# EAGLE design main (EAGLE 9.3.0)
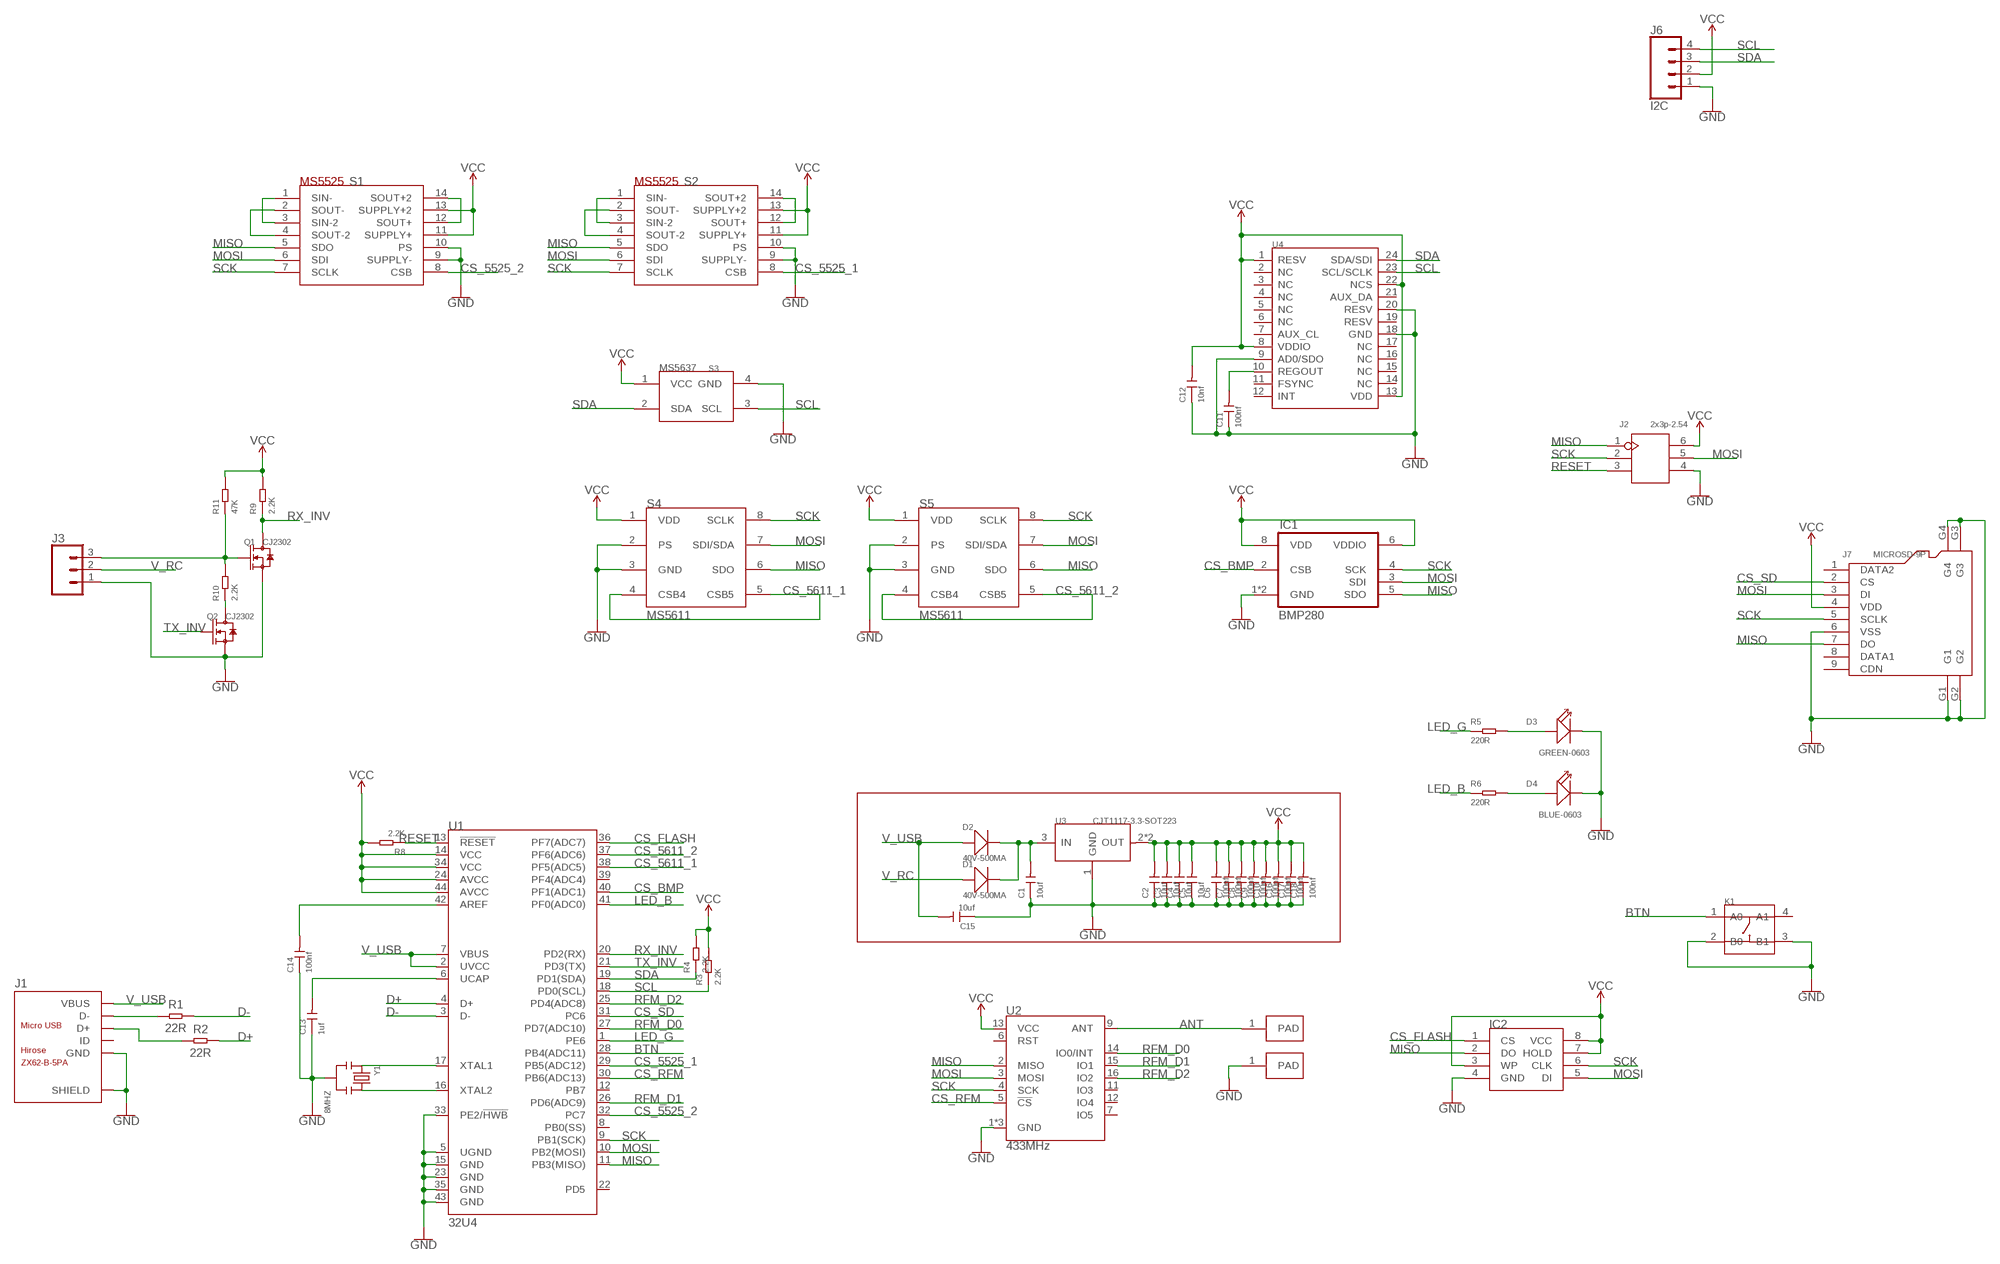
[diagram p0: schematic, sheet 1]

## Parts
C1  10uf  CERAMIC-10UF-25V-10%-X5R(0805)  [C0805]
C2  10uf  CERAMIC-10UF-25V-10%-X5R(0805)  [C0805]
C3  10uf  CERAMIC-10UF-25V-10%-X5R(0805)  [C0805]
C4  10uf  CERAMIC-10UF-25V-10%-X5R(0805)  [C0805]
C5  10uf  CERAMIC-10UF-25V-10%-X5R(0805)  [C0805]
C6  100nf  CERAMIC-100NF-50V-10%-X7R(0603)  [C0603]
C7  100nf  CERAMIC-100NF-50V-10%-X7R(0603)  [C0603]
C8  100nf  CERAMIC-100NF-50V-10%-X7R(0603)  [C0603]
C9  100nf  CERAMIC-100NF-50V-10%-X7R(0603)  [C0603]
C10  100nf  CERAMIC-100NF-50V-10%-X7R(0603)  [C0603]
C11  100nf  CERAMIC-100NF-50V-10%-X7R(0603)  [C0603]
C12  10nf  CERAMIC-10NF-50V-10%-X7R(0603)  [C0603]
C13  1uf  CERAMIC-1UF-25V-10%-X7R(0603)  [C0603]
C14  100nf  CERAMIC-100NF-50V-10%-X7R(0603)  [C0603]
C15  10uf  CERAMIC-10UF-25V-10%-X5R(0805)  [C0805]
C16  100nf  CERAMIC-100NF-50V-10%-X7R(0603)  [C0603]
C17  100nf  CERAMIC-100NF-50V-10%-X7R(0603)  [C0603]
C18  100nf  CERAMIC-100NF-50V-10%-X7R(0603)  [C0603]
D1  40V-500MA  SMD-DIODE-SCHOTTKY-40V-500MA(SOD-123)  [SOD-123]
D2  40V-500MA  SMD-DIODE-SCHOTTKY-40V-500MA(SOD-123)  [SOD-123]
D3  GREEN-0603  SMD-LED-CLEAR-GREEN(0603)  [LED-0603]
D4  BLUE-0603  SMD-LED-CLEAR-BLUE(0603)  [LED-0603]
IC1  BMP280  [BMP280]
IC2  W25Q32BVWSON8_6X5  [SON127P600X500X75-8]
J1  ZX62-B-5PA  MICRO-USB-SMD(ZX62-B-5PA)  [MICRO-USB5+6P-SMD-0.65-AB]
J2  2x3p-2.54  DIP-BLACK-MALE-HEADER(2X3P-2.54）-2.54  [H2X3-2.54]
J3  CONN_03  [1X03]
J6  I2C  CONN_04  [1X04]
J7  MICROSD-9P  MICRO-SD-CARD-HOLDER-9P  [MICRO-SD9+4P-SMD-16.1X14.5X1.85MM]
K1  SMD-SWITCH-TACTILE-SPST-NO(4P-D6.0MM)  [SW4-SMD-6.0X6.0X5.0MM]
Q1  CJ2302  SMD-MOSFET-N-CH-20V-2.1A-CJ2302(SOT-23)  [SOT-23]
Q2  CJ2302  SMD-MOSFET-N-CH-20V-2.1A-CJ2302(SOT-23)  [SOT-23]
R1  22R  SMD-RES-22R-5%-1/10W(0603)  [R0603]
R2  22R  SMD-RES-22R-5%-1/10W(0603)  [R0603]
R3  2.2K  SMD-RES-2.2K-5%-1/10W(0603)  [R0603]
R4  2.2K  SMD-RES-2.2K-5%-1/10W(0603)  [R0603]
R5  220R  SMD-RES-220R-5%-1/10W(0603)  [R0603]
R6  220R  SMD-RES-220R-5%-1/10W(0603)  [R0603]
R8  2.2K  SMD-RES-2.2K-5%-1/10W(0603)  [R0603]
R9  2.2K  SMD-RES-2.2K-5%-1/10W(0603)  [R0603]
R10  2.2K  SMD-RES-2.2K-5%-1/10W(0603)  [R0603]
R11  47K  SMD-RES-47K-5%-1/10W(0603)  [R0603]
S1  MS5525  [SOIC14-WIDE]
S2  MS5525  [SOIC14-WIDE]
S3  MS5637  [MS5637]
S4  MS5611  [MS5611]
S5  MS5611  [MS5611]
U1  32U4  ATMEGA32U41:1  [QFN-44-NOPAD_1:1]
U2  433MHz  RFM69HCW-433  [RFM69HCW-XXXS2]
U3  CJT1117-3.3-SOT223  PMIC-CJT1117-3.3(SOT223)  [SOT-223]
U4  MOTION/POSITION-MPU-9250(QFN24G)  [QFN24G-0.4-3X3MM]
U$1  PADPAD_2.5X1.5  [PAD_2.5X1.5]
U$2  PADPAD_2.5X1.5  [PAD_2.5X1.5]
Y1  8MHZ  SMD-CRYSTAL-8MHZ--0.3%-150R(3P-3.6X1.3MM)  [X3-SMD-3.6X1.3X0.8MM]

## Nets
ANT: U2.9(ANT) U$2.1(PAD)
BTN: K1.1(A0) U1.28(PB4(ADC11))
CS_5525_1: S2.8(CSB) U1.29(PB5(ADC12))
CS_5525_2: S1.8(CSB) U1.32(PC7)
CS_5611_1: S4.4(CSB4) S4.5(CSB5) U1.38(PF5(ADC5))
CS_5611_2: S5.4(CSB4) S5.5(CSB5) U1.37(PF6(ADC6))
CS_BMP: IC1.2(CSB) U1.40(PF1(ADC1))
CS_FLASH: IC2.1(CS) U1.36(PF7(ADC7))
CS_RFM: U1.30(PB6(ADC13)) U2.5(!CS)
CS_SD: J7.2(CS) U1.31(PC6)
D+: R2.2 U1.4(D+)
D-: R1.2 U1.3(D-)
GND: C1.1 C2.1 C3.1 C4.1 C5.1 C6.1 C7.1 C8.1 C9.1 C10.1 C11.1 C12.1 C13.1 C14.1 C15.1 C16.1 C17.1 C18.1 D3.- D4.- IC1.1(GND) IC1.7(GND) IC2.4(GND) J1.5(GND) J1.P1(SHIELD) J1.P2(SHIELD) J1.P3(SHIELD) J1.P4(SHIELD) J1.P5(SHIELD) J1.P6(SHIELD) J2.4 J3.1 J6.1 J7.6(VSS) J7.G1 J7.G2 J7.G3 J7.G4 K1.2(B0) K1.3(B1) Q1.2(S) Q2.2(S) S1.9(SUPPLY-) S1.10(PS) S2.9(SUPPLY-) S2.10(PS) S3.4(GND) S4.2(PS) S4.3(GND) S5.2(PS) S5.3(GND) U1.5(UGND) U1.15(GND) U1.23(GND) U1.33(PE2/!HWB) U1.35(GND) U1.43(GND) U2.1(GND) U2.8(GND) U2.10(GND) U3.1(GND) U4.9(AD0/SDO) U4.18(GND) U4.20(RESV) U$1.1(PAD) Y1.2
LED_B: R6.1 U1.41(PF0(ADC0))
LED_G: R5.1 U1.1(PE6)
MISO: IC1.5(SDO) IC2.2(DO) J2.1 J7.7(DO) S1.5(SDO) S2.5(SDO) S4.6(SDO) S5.6(SDO) U1.11(PB3(MISO)) U2.2(MISO)
MOSI: IC1.3(SDI) IC2.5(DI) J2.5 J7.3(DI) S1.6(SDI) S2.6(SDI) S4.7(SDI/SDA) S5.7(SDI/SDA) U1.10(PB2(MOSI)) U2.3(MOSI)
N$1: U1.17(XTAL1) Y1.1
N$2: U1.16(XTAL2) Y1.3
N$3: J1.2(D-) R1.1
N$4: J1.3(D+) R2.1
N$5: C1.2 D1.- D2.- U3.3(IN)
N$6: Q2.3(D) R10.1
N$7: S2.1(SIN-) S2.3(SIN-2)
N$8: S2.2(SOUT-) S2.4(SOUT-2)
N$9: S2.12(SOUT+) S2.14(SOUT+2)
N$10: C11.2 U4.10(REGOUT)
N$11: S1.1(SIN-) S1.3(SIN-2)
N$12: S1.2(SOUT-) S1.4(SOUT-2)
N$13: S1.12(SOUT+) S1.14(SOUT+2)
N$14: D3.+ R5.2
N$15: D4.+ R6.2
N$16: C13.2 U1.6(UCAP)
N$19: C14.2 U1.42(AREF)
RC_IN: J3.3 Q1.1(G) R10.2 R11.1
RESET: J2.3 R8.1 U1.13(!RESET)
RFM_D0: U1.27(PD7(ADC10)) U2.14(IO0/INT)
RFM_D1: U1.26(PD6(ADC9)) U2.15(IO1)
RFM_D2: U1.25(PD4(ADC8)) U2.16(IO2)
RX_INV: Q1.3(D) R9.1 U1.20(PD2(RX))
SCK: IC1.4(SCK) IC2.6(CLK) J2.2 J7.5(SCLK) S1.7(SCLK) S2.7(SCLK) S4.8(SCLK) S5.8(SCLK) U1.9(PB1(SCK)) U2.4(SCK)
SCL: J6.4 R3.1 S3.3(SCL) U1.18(PD0(SCL)) U4.23(SCL/SCLK)
SDA: J6.3 R4.1 S3.2(SDA) U1.19(PD1(SDA)) U4.24(SDA/SDI)
TX_INV: Q2.1(G) U1.21(PD3(TX))
V_RC: D1.+ J3.2
V_USB: C15.2 D2.+ J1.1(VBUS) U1.2(UVCC) U1.7(VBUS)
VCC: C2.2 C3.2 C4.2 C5.2 C6.2 C7.2 C8.2 C9.2 C10.2 C12.2 C16.2 C17.2 C18.2 IC1.6(VDDIO) IC1.8(VDD) IC2.3(WP) IC2.7(HOLD) IC2.8(VCC) J2.6 J6.2 J7.4(VDD) R3.2 R4.2 R8.2 R9.2 R11.2 S1.11(SUPPLY+) S1.13(SUPPLY+2) S2.11(SUPPLY+) S2.13(SUPPLY+2) S3.1(VCC) S4.1(VDD) S5.1(VDD) U1.14(VCC) U1.24(AVCC) U1.34(VCC) U1.44(AVCC) U2.13(VCC) U3.2(OUT) U3.TER(OUT) U4.1(RESV) U4.8(VDDIO) U4.13(VDD) U4.22(NCS)
Unconnected: J1.4(ID) J7.1(DATA2) J7.8(DATA1) J7.9(CDN) K1.4(A1) U1.8(PB0(SS)) U1.12(PB7) U1.22(PD5) U1.39(PF4(ADC4)) U2.6(RST) U2.7(IO5) U2.11(IO3) U2.12(IO4) U4.2(NC) U4.3(NC) U4.4(NC) U4.5(NC) U4.6(NC) U4.7(AUX_CL) U4.11(FSYNC) U4.12(INT) U4.14(NC) U4.15(NC) U4.16(NC) U4.17(NC) U4.19(RESV) U4.21(AUX_DA)

## Library data of the parts
C1-C5 C15 = Seeed-Capacitor:CERAMIC-10UF-25V-10%-X5R(0805): 302010178; MPN: CC0805KKX5R8BB106
C6-C11 C14 C16-C18 = Seeed-Capacitor:CERAMIC-100NF-50V-10%-X7R(0603): 302010138; MPN: CC0603KRX7R9BB104
C12 = Seeed-Capacitor:CERAMIC-10NF-50V-10%-X7R(0603): 302010140; MPN: CC0603KRX7R9BB103
C13 = Seeed-Capacitor:CERAMIC-1UF-25V-10%-X7R(0603): 302010139; MPN: CC0603KRX7R8BB105
D1 D2 = Seeed-Diode:SMD-DIODE-SCHOTTKY-40V-500MA(SOD-123): 304020012; MPN: B0540W
D3 = Seeed-LED:SMD-LED-CLEAR-GREEN(0603): 304090043; MPN: 19-217-G7C-AN1P2-3T
D4 = Seeed-LED:SMD-LED-CLEAR-BLUE(0603): 304090045; MPN: 19-217-BHC-ZL1M2RY-3T
IC1 = bosch-bmp280:BMP280: The BMP280 is an absolute barometric pressure sensor especially designed for mobile applications. The sensor module is housed in an extremely compact 8-pin metal-lid LGA package with a footprint of only 2.0 × 2.5 mm2 and 0.95 mm package height. Its small dimensions and its low power consumption of 2.7 μA @1Hz allow the implementation in battery driven devices such as mobile phones, GPS modules or watches. The library has been designed by Richard Magdycz <https://www.facebook.com/groups/eaglecadsoftUK>
IC2 = Custom_old:W25Q32BV
J1 = Seeed-Connector:MICRO-USB-SMD(ZX62-B-5PA): 320010005; MPN: ZX62-B-5PA
J2 = Seeed-Connector:DIP-BLACK-MALE-HEADER(2X3P-2.54）: 320020077; MPN: P125-12A1BS116A1
J3 = SparkFun-Connectors:CONN_03: Multi connection point. Often used as Generic Header-pin footprint for 0.1 inch spaced/style header connections On any of the 0.1 inch spaced packages, you can populate with these: Break Away Headers - Straight <https://www.sparkfun.com/products/116> (PRT-00116) Break Away Male Headers - Right Angle <https://www.sparkfun.com/products/553> (PRT-00553) Female Headers <https://www.sparkfun.com/products/115> (PRT-00115) Break Away Headers - Machine Pin <https://www.sparkfun.com/products/117> (PRT-00117) Break Away Female Headers - Swiss Machine Pin <https://www.sparkfun.com/products/743> (PRT-00743) Stackable Header - 3 Pin (Female, 0.1") <https://www.sparkfun.com/products/13875> (PRT-13875) For SCREWTERMINALS and SPRING TERMINALS visit here: Screw Terimnals on SparkFun.com <https://www.sparkfun.com/search/results?term=Screw+Terminals> (5mm/3.5mm/2.54mm spacing) This device is also useful as a general connection point to wire up your design to another part of your project. Our various solder wires solder well into these plated through hole pads. Hook-Up Wire - Assortment (Stranded, 22 AWG) <https://www.sparkfun.com/products/11375> (PRT-11375) Hook-Up Wire - Assortment (Solid Core, 22 AWG) <https://www.sparkfun.com/products/11367> (PRT-11367) View the entire wire category on our website here <https://www.sparkfun.com/categories/141> Special notes: Molex polarized connector foot print use with SKU : PRT-08232 with associated crimp pins and housings.; PROD_ID: XXX-00000; VALUE: 455-1750-1-ND
J6 = SparkFun-Connectors:CONN_04: Multi connection point. Often used as Generic Header-pin footprint for 0.1 inch spaced/style header connections On any of the 0.1 inch spaced packages, you can populate with these: Break Away Headers - Straight <https://www.sparkfun.com/products/116> (PRT-00116) Break Away Male Headers - Right Angle <https://www.sparkfun.com/products/553> (PRT-00553) Female Headers <https://www.sparkfun.com/products/115> (PRT-00115) Break Away Headers - Machine Pin <https://www.sparkfun.com/products/117> (PRT-00117) Break Away Female Headers - Swiss Machine Pin <https://www.sparkfun.com/products/743> (PRT-00743) For SCREWTERMINALS and SPRING TERMINALS visit here: Screw Terimnals on SparkFun.com <https://www.sparkfun.com/search/results?term=Screw+Terminals> (5mm/3.5mm/2.54mm spacing) This device is also useful as a general connection point to wire up your design to another part of your project. Our various solder wires solder well into these plated through hole pads. Hook-Up Wire - Assortment (Stranded, 22 AWG) <https://www.sparkfun.com/products/11375> (PRT-11375) Hook-Up Wire - Assortment (Solid Core, 22 AWG) <https://www.sparkfun.com/products/11367> (PRT-11367) View the entire wire category on our website here <https://www.sparkfun.com/categories/141> Special notes: Molex polarized connector foot print use with SKU : PRT-08231 with associated crimp pins and housings. 1MM SMD Version SKU: PRT-10208; PROD_ID: CONN-09696
J7 = Seeed-Connector:MICRO-SD-CARD-HOLDER-9P: 320090008
K1 = Seeed-Switch:SMD-SWITCH-TACTILE-SPST-NO(4P-D6.0MM): 311020004; MPN: DTSM-62K-S-V-T/R(SN431)
Q1 Q2 = Seeed-Transistor:SMD-MOSFET-N-CH-20V-2.1A-CJ2302(SOT-23): 305030015; MPN: CJ2302
R1 R2 = Seeed-Resistor:SMD-RES-22R-5%-1/10W(0603): 301010289; MPN: RC0603JR-0722RL
R3 R4 R8-R10 = Seeed-Resistor:SMD-RES-2.2K-5%-1/10W(0603): 301010124; MPN: RC0603JR-072K2L
R5 R6 = Seeed-Resistor:SMD-RES-220R-5%-1/10W(0603): 301010163; MPN: RC0603JR-07220RL
R11 = Seeed-Resistor:SMD-RES-47K-5%-1/10W(0603): 301010084; MPN: RC0603JR-0747KL
S1 S2 = Custom_old:MS5525
S3 = Custom_old:MS5637
S4 S5 = Custom_old:MS5611
U1 = SparkFun-IC-Microcontroller:ATMEGA32U4: Atmel MCU, 32KByte Atmel 44-pin 8-bit Microcontroller with 32KBytes of ISP Flash and USB Controller Datasheet <http://cdn.sparkfun.com/datasheets/Dev/Arduino/Boards/ATMega32U4.pdf> SparkFun Products LilyPad Arduino USB - ATmega32U4 Board <https://www.sparkfun.com/products/12049> (DEV-12049) Pro Micro - 5V/16MHz <https://www.sparkfun.com/products/12640> (DEV-12640) Pro Micro - 3.3V/8MHz <https://www.sparkfun.com/products/12587> (DEV-12587) Fio v3 - ATmega32U4 <https://www.sparkfun.com/products/11520> (DEV-11520) Qduino Mini <https://www.sparkfun.com/products/13614> (DEV-13614) Makey Makey - Standard Kit <https://www.sparkfun.com/products/11511> (WIG-11511) Makey Makey Deluxe Kit <https://www.sparkfun.com/products/11519> (WIG-11519); PROD_ID: IC-10828
U2 = SparkFun-RF:RFM69H: Hope RF RFM69H ISM Transceiver Module The RFM69H is a transceiver module capable of operation over a wide frequency range, including the 315,433,868 and 915MHz license-free ISM (Industry Scientific and Medical) frequency bands. All major RF communication parameters are programmable and most of them can be dynamically set. The RFM69H offers the unique advantage of programmable narrow-band and wide- band communication modes. The RFM69H is optimized for low power consumption while offering high RF output power and channelized operation.Compliance ETSI and FCC regulations. Datasheet <http://www.hoperf.cn/upload/docs/RF/SX/RFM69H_DataSheet_v1.3.pdf> SparkFun Products RFM69HCW Wireless Transceiver - 915MHz <https://www.sparkfun.com/products/13909> (COM-13909) RFM69HCW Wireless Transceiver - 434MHz <https://www.sparkfun.com/products/13910> (COM-13910) SparkFun RFM69 Breakout (915MHz) <https://www.sparkfun.com/products/12775> (WRL-12775) SparkFun RFM69 Breakout (434MHz) <https://www.sparkfun.com/products/12823> (WRL-12823); PROD_ID: IC-12053
U3 = Seeed-IC:PMIC-CJT1117-3.3(SOT223): 310030097; MPN: CJT1117-3.3
U4 = Seeed-Sensor:MOTION/POSITION-MPU-9250(QFN24G): 314990005
U$1 U$2 = Custom_old:PAD
Y1 = Seeed-Crystal Oscillator:SMD-CRYSTAL-8MHZ--0.3%-150R(3P-3.6X1.3MM): 306010053

## Board
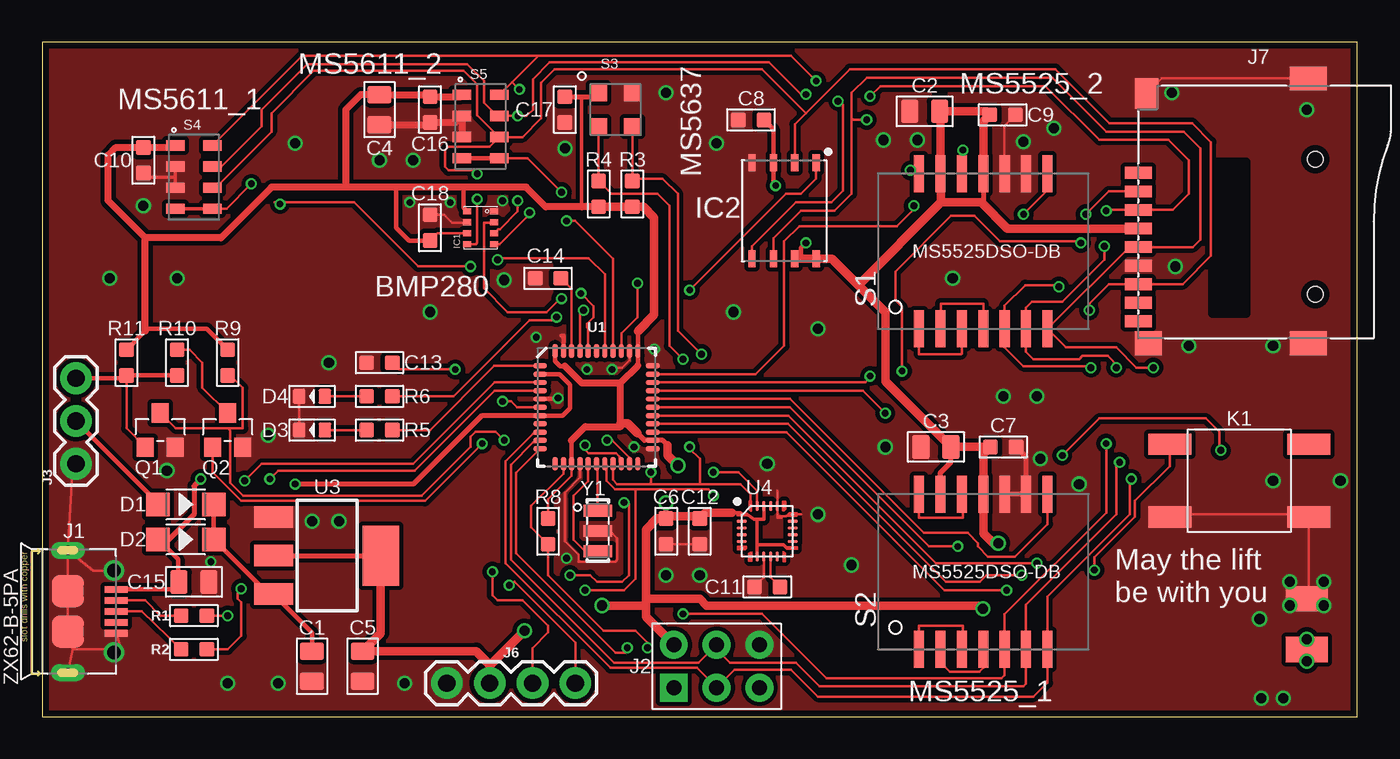
[diagram p1: board, top side]
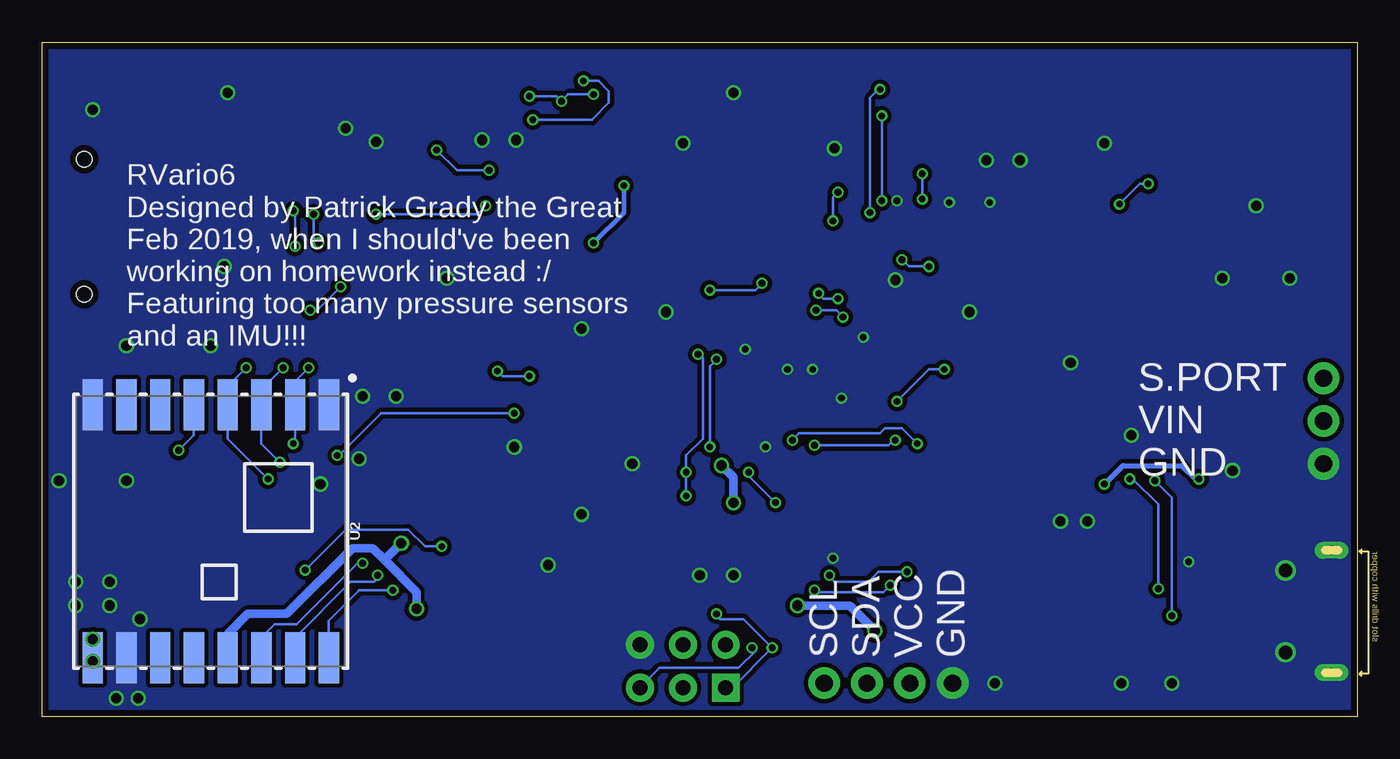
[diagram p2: board, bottom side, seen from below]

Size 78 x 40 mm. Coordinates in mm from the lower left corner, seen from the top.
Outline: 0,0 78,0 78,40 0,40 0,0
Copper layers (1*16): Top 0.035559375mm / dielectric 1.6mm / Bottom 0.035559375mm
Design rules "PATRICK-2lyr": minimum track width 6mil, minimum drill 10mil, track to track 6mil, track to pad 6mil, pad to pad 6mil, via to via 6mil, smd to smd 6mil, copper to edge 15mil, drill to drill 6mil, minimum pad ring 5mil, minimum via ring 5mil, stop-mask expansion 2.5mil, vias tented up to drill 25mil, thermal gap 10mil

### Footprints (pad centres in the part's own frame; a part is rotated, then mirrored left to right if it is on the bottom)
C0805 = smd 1.397 x 1.016: 1 0,0.889; 2 0,-0.889
C0603 = smd 0.889 x 0.889: 1 0,0.762; 2 0,-0.762
SOD-123 = smd 1.397 x 1.397: + -1.651,0; - 1.651,0
LED-0603 = smd 0.762 x 0.889: + -0.762,0; - 0.762,0
BMP280 = smd 0.35 x 0.5: 1 0.975,-0.8; 2 0.325,-0.8; 3 -0.325,-0.8; 4 -0.975,-0.8; 5 -0.975,0.8; 6 -0.325,0.8; 7 0.325,0.8; 8 0.975,0.8
SON127P600X500X75-8 = smd 1.012 x 0.432: 1 -2.85,1.905; 2 -2.85,0.635; 3 -2.85,-0.635; 4 -2.85,-1.905; 5 2.85,-1.905; 6 2.85,-0.635; 7 2.85,0.635; 8 2.85,1.905
MICRO-USB5+6P-SMD-0.65-AB = smd 0.4 x 1.35: 1 -1.3,2.875; 2 -0.65,2.875; 3 0,2.875; 4 0.65,2.875; 5 1.3,2.875 | smd 1.9 x 1.9: P1 -1.2,0; P2 1.2,0 | drill 0.508 pad 1.016 long: P3 -3.625,0; P4 3.625,0 | drill 0.8: P5 -2.425,2.73; P6 2.425,2.73
H2X3-2.54 = drill 0.889 pad 1.651 square: 1 -1.27,2.54 | drill 0.889 pad 1.651: 2 -1.27,0; 3 -1.27,-2.54; 4 1.27,-2.54; 5 1.27,0; 6 1.27,2.54
1X03 = drill 1.016 pad 1.88: 1 0,0; 2 2.54,0; 3 5.08,0
1X04 = drill 1.016 pad 1.88: 1 0,0; 2 2.54,0; 3 5.08,0; 4 7.62,0
MICRO-SD9+4P-SMD-16.1X14.5X1.85MM = smd 1.6 x 0.7: 1 0,2.25; 2 0,1.15; 3 0,0.05; 4 0,-1.05; 5 0,-2.15; 6 0,-3.25; 7 0,-4.35; 8 0,-5.45; 9 0,-6.55 | smd 1.6 x 1.4: G1 0.6,-7.85 | smd 2.2 x 1.4: G2 10.1,-7.85; G3 10.1,7.85 | smd 1.4 x 1.8: G4 0.5,6.95 | hole 0.9: 10.5,-4.95; 10.5,3.05
SW4-SMD-6.0X6.0X5.0MM = smd 2.54 x 1.27: 1 -4.129,2.159; 2 -4.129,-2.159; 3 4.129,-2.159; 4 4.129,2.159
SOT-23 = smd 1.016 x 1.143: 1 -0.889,-1.016; 2 0.889,-1.016; 3 0,1.016
R0603 = smd 0.889 x 0.889: 1 0,0.762; 2 0,-0.762
SOIC14-WIDE = smd 0.6 x 2.2: 1 0,0; 2 1.27,0; 3 2.54,0; 4 3.81,0; 5 5.08,0; 6 6.35,0; 7 7.62,0; 8 7.62,9.2; 9 6.35,9.2; 10 5.08,9.2; 11 3.81,9.2; 12 2.54,9.2; 13 1.27,9.2; 14 0,9.2
MS5637 = smd 1 x 1: 1 -1,1; 2 -1,-1; 3 1,-1; 4 1,1
MS5611 = smd 1.1 x 0.6: 1 -1.1,1.875; 2 -1.1,0.625; 3 -1.1,-0.625; 4 -1.1,-1.875; 5 1.1,-1.875; 6 1.1,-0.625; 7 1.1,0.625; 8 1.1,1.875
QFN-44-NOPAD_1:1 = smd 0.8 x 0.3: 1 -3.337,2.458; 2 -3.337,1.958; 3 -3.337,1.479; 4 -3.337,0.979; 5 -3.337,0.5; 6 -3.337,0; 7 -3.337,-0.5; 8 -3.337,-0.979; 9 -3.337,-1.479; 10 -3.337,-1.958; 11 -3.337,-2.458; 23 3.337,-2.458; 24 3.337,-1.958; 25 3.337,-1.479; 26 3.337,-0.979; 27 3.337,-0.5; 28 3.337,0; 29 3.337,0.5; 30 3.337,0.979; 31 3.337,1.479; 32 3.337,1.958; 33 3.337,2.458 | smd 0.3 x 0.8: 12 -2.458,-3.337; 13 -1.958,-3.337; 14 -1.479,-3.337; 15 -0.979,-3.337; 16 -0.5,-3.337; 17 0,-3.337; 18 0.5,-3.337; 19 0.979,-3.337; 20 1.479,-3.337; 21 1.958,-3.337; 22 2.458,-3.337; 34 2.458,3.337; 35 1.958,3.337; 36 1.479,3.337; 37 0.979,3.337; 38 0.5,3.337; 39 0,3.337; 40 -0.5,3.337; 41 -0.979,3.337; 42 -1.479,3.337; 43 -1.958,3.337; 44 -2.458,3.337
RFM69HCW-XXXS2 = smd 3 x 1.2: 1 -7.5,7; 2 -7.5,5; 3 -7.5,3; 4 -7.5,1; 5 -7.5,-1; 6 -7.5,-3; 7 -7.5,-5; 8 -7.5,-7; 9 7.5,-7; 10 7.5,-5; 11 7.5,-3; 12 7.5,-1; 13 7.5,1; 14 7.5,3; 15 7.5,5; 16 7.5,7
SOT-223 = smd 1.27 x 2.286: 1 -2.286,-3.175; 2 0,-3.175; 3 2.286,-3.175 | smd 3.556 x 2.159: TER 0,3.175
QFN24G-0.4-3X3MM = smd 0.2 x 0.15: 1 -1.5,1; 6 -1.5,-1; 13 1.5,-1; 18 1.5,1 | smd 0.6 x 0.2: 2 -1.5,0.6; 3 -1.5,0.2; 4 -1.5,-0.2; 5 -1.5,-0.6; 14 1.5,-0.6; 15 1.5,-0.2; 16 1.5,0.2; 17 1.5,0.6 | smd 0.15 x 0.2: 7 -1,-1.5; 12 1,-1.5; 19 1,1.5; 24 -1,1.5 | smd 0.2 x 0.6: 8 -0.6,-1.5; 9 -0.2,-1.5; 10 0.2,-1.5; 11 0.6,-1.5; 20 0.6,1.5; 21 0.2,1.5; 22 -0.2,1.5; 23 -0.6,1.5
PAD_2.5X1.5 = smd 2.5 x 1.5: 1 0,0
X3-SMD-3.6X1.3X0.8MM = smd 0.7 x 1.7: 1 -1.2,0; 2 0,0; 3 1.2,0

### Placement (x,y rotation side)
C1  16,3 180 top
C2  52.34,35.9 90 top
C3  53,16 90 top
C4  20,36 180 top
C5  19,3 180 top
C6  37,11 180 top
C7  57,16 270 top
C8  42.04,35.39 90 top
C9  56.96,35.69 270 top
C10  6,33 180 top
C11  43,7.7 90 top
C12  39,11 180 top
C13  20,21 90 top
C14  30,26 90 top
C15  9,8 270 top
C16  23,36 180 top
C17  31,36 180 top
C18  23,29 0 top
D1  8.52,12.6 0 top
D2  8.52,10.52 0 top
D3  16,17 180 top
D4  16,19 180 top
IC1  26,29 90 top
IC2  44,30 270 top
J1  1.52,6.25 270 top
J2  40,3 90 top
J3  2,15 90 top
J6  24,2 0 top
J7  65,30 0 top
K1  71,14 0 top
Q1  7,17 0 top
Q2  11,17 0 top
R1  9,6 90 top
R2  9,4 90 top
R3  35,31 0 top
R4  33,31 0 top
R5  20,17 270 top
R6  20,19 270 top
R8  30,11 180 top
R9  11,21 180 top
R10  8,21 0 top
R11  5,21 180 top
S1  52,23 0 top
S2  52,4 0 top
S3  34,36 0 top
S4  9,32 0 top
S5  26,35 0 top
U1  32.87,18.35 0 top
U2  68,11 270 bottom
U3  16.9,9.56 270 top
U4  43,11 0 top
U$1  75,7 0 top
U$2  75,4 0 top
Y1  32.95,11.02 270 top

### Tracks (layer width: path | path; a pad name or v marks a point on that pad's centre or on a via)
ANT  (via drill 0.6)
  Top 0.305: v75,4.6 U$2.1 v75,3.3
  Bottom 0.305: U2.9 v75,3.3
BTN  (via drill 0.4)
  Top 0.152: K1.1 66.87,14.87 64.81,12.8 64.81,11.87 62.4,9.47 v62.4,8.7 62.4,8.6 | v54.3,10.1 52.6,10.1 44.35,18.35 U1.28
  Bottom 0.152: v62.4,8.7 60,11.1 56.3,11.1 55.3,10.1 v54.3,10.1
CS_5525_1
  Top 0.152: U1.29 44.35,18.85 52.3,10.9 54.9,10.9 55.5,10.3 55.5,10.1 56.1,9.5 57.7,9.5 59.62,11.42 S2.8
CS_5525_2  (via drill 0.4)
  Top 0.152: U1.32 42.31,20.31 44,22 44,28.2 44.9,29.1 50.7,29.1 51.7,30.1 v51.7,30.3 | v58.2,29.8 59.62,31.22 S1.8
  Bottom 0.152: v51.7,30.3 52.2,29.8 v58.2,29.8
CS_5611_1  (via drill 0.4)
  Top 0.152: U1.38 33.37,26.23 32.4,27.2 26.9,27.2 v27,27.1 | v25.4,26.7 22.3,26.7 18.5,30.5 14,30.5 | 13.8,30.5 14,30.5 | 14,30.5 v14.1,30.4 | v12.4,31.6 10.93,30.12 9.9,30.12
  Top 0.203: S4.4 9.9,30.12 S4.5
  Bottom 0.152: v27,27.1 26.6,26.7 v25.4,26.7 | v14.1,30.4 12.9,31.6 v12.4,31.6
CS_5611_2  (via drill 0.4)
  Top 0.152: U1.37 33.85,27.15 31.6,29.4 v31.1,29.4 | v30.8,31.1 28.77,33.12 S5.5
  Top 0.254: S5.4 S5.5
  Bottom 0.152: v31.1,29.4 31.1,30.8 v30.8,31.1
CS_BMP  (via drill 0.4)
  Top 0.152: IC1.2 26.77,29.3 26.2,29.3 26.2,25.4 27.6,24 29.9,24 30.7,24.8 v30.8,24.8 | v31.95,25.1 32.7,24.35 32.7,23.7 32.3,23.3 32.3,23.1 32.37,23.03 U1.40
  Bottom 0.152: v30.8,24.8 31.65,24.8 v31.95,25.1
CS_FLASH  (via drill 0.4)
  Top 0.152: v35.3,25.7 35.3,23.7 34.35,22.75 U1.36 | v38.4,25.3 44.1,31 45,31 45.91,31.91 IC2.1
  Bottom 0.152: v38.4,25.3 35.7,25.3 v35.3,25.7
CS_RFM  (via drill 0.4)
  Top 0.152: U1.30 48.67,19.33 v50,18 | v60.5,15.5 62.7,17.7 69,17.7 69.8,16.9 69.8,15.8 v69.9,15.8
  Bottom 0.152: v50,18 57.9,18 60.5,15.4 v60.5,15.5 | v69.9,15.8 69,16.7 U2.5
CS_SD  (via drill 0.4)
  Top 0.152: U1.31 48.83,19.83 49.1,20.1 v49.1,20.2 | v51,20.5 51,24.3 50.6,24.7 50.6,26.4 53.9,29.7 55.3,29.7 56.8,28.2 61.5,28.2 v61.6,28.1 | v61.9,29.8 63.25,31.15 J7.2
  Bottom 0.152: v49.1,20.2 50.7,20.2 v51,20.5 | v61.6,28.1 61.9,28.4 v61.9,29.8
D+  (via drill 0.4)
  Top 0.152: R2.2 11,4 11.8,4.8 11.8,6.8 11.6,7 11.6,7.6 v11.8,7.6 | v13.5,14.1 14,14.6 22.1,14.6 26.83,19.33 U1.4
  Bottom 0.152: v11.8,7.6 11.8,12.6 13.3,14.1 v13.5,14.1
D-  (via drill 0.4)
  Top 0.152: R1.2 v11,6 | v12,14 13,15 22,15 26.83,19.83 U1.3
  Bottom 0.152: v11,6 11,13 v12,14
GND  (via drill 0.4, 0.6)
  Top 0.152: J1.P4 1.82,4 | 1.82,4 J1.P2 J1.P1 J1.P3 | J1.P5 3.02,8.68 J1.P3 | J1.5 4.7,3.97 J1.P6 4.38,4 1.82,4 | J3.1 1.82,14.82 J1.P3 | C6.1 C12.1 | C11.1 42.8,8.26 U4.9 | D3.- D4.- | 32.97,11 Y1.2 33.68,11.02 34.1,10.6 34.1,9.3 34,9.2 31.8,9.2 31.8,9.6 31,10.4 31,13.3 31.89,14.19 U1.15 | 66.71,12 74.97,12 K1.3 75.13,7.13 U$1.1 74.4,7 | 66,12 66.71,12 | 66.71,12 K1.2 | J7.G3 66.4,37.85 J7.G4 | S1.10 57.08,35.05 C9.1 | C18.1 23.84,29.76 24.3,29.3 25.18,29.3 IC1.7 | U1.35 34.83,21.13 34.4,20.7 33.9,20.7 v33.8,20.6 | 43.6,13.4 U4.20 43.6,11.9 | 45,12 U4.18 44.43,11.93 44.13,11.93 44.11,11.9 43.6,11.9 | 43.6,11.9 43.6,11.8 43.85,11.8
  Top 0.203: S4.3 7.9,32 | 7.9,32 S4.2 | C10.1 6.24,32 7.9,32
  Top 0.254: U1.5 30.6,18.85 v30.6,18.9 | U1.43 30.91,22.6 30.8,22.6
  Top 0.305: C7.1 58.35,15.41 S2.9 S2.10
  Top 0.406: C4.1 22.87,35.11 C16.1 24.51,35.24 S5.2 S5.3
  other vias: 16,11.6 17.6,11.6 13.4,16.7 7.4,14.6 10,9.2 39,8.4 37,8.4 48,9 31.1,9.4 29.3,22.5 27.4,25.9 20,33 22,33 31,33.7 40,34 68,22 73,22 75,36 67,37 67.2,26.7 21.8,30.5 24.2,30.5 32.3,20.6 36.3,21.8 35.1,16 49.9,34.2 51.9,34.2 58.2,34.1 60,34.9 27.3,30.6 59.2,15.3 61.5,13.8 50,16 43,15 46,12 6,30.3 4,26 8,26 23,24 15,34 37,37 41,24 46,23 54,26 11,2 14,2 21.5,2 17,21 57,19 59,19 72.3,1.1 73.6,1.1 72.2,5.8 74,8 74,6.6 76,6.6 76,8 77,14 73,14
  pour Top (isolate 0.254, rank 6, no thermals): 0,40 78,40 78,0 0,0
  pour Bottom (isolate 0.254, rank 6, no thermals): 0,40 78,40 78,0 0,0
LED_B  (via drill 0.4)
  Top 0.152: R6.1 24.4,19 28.9,23.5 30.4,23.5 30.4,23.6 v30.5,23.7 | v32.1,24.1 31.89,23.89 U1.41
  Bottom 0.152: v30.5,23.7 30.9,24.1 v32.1,24.1
LED_G
  Top 0.152: R5.1 23,17 26.81,20.81 U1.1
MISO  (via drill 0.4)
  Top 0.152: U1.11 28.11,14.46 28.11,9.7 34,3.8 34.6,3.8 34.8,4 v34.7,4.1 | v38,6.1 42.7,6.1 46.5,2.3 56.9,2.3 57.08,2.48 S2.5 57.08,6.08 63.1,12.1 v63.1,16.2 | v60.3,25.5 60.2,25.6 58.3,25.6 57.08,24.38 S1.5 57.08,21.92 58.2,20.8 62.2,20.8 v62.2,20.7 | v62.1,24.1 62.1,24.5 63.25,25.65 J7.7 67.65,25.65 69.32,27.32 69.32,34.08 68.2,35.2 63.3,35.2 60.1,38.4 47.9,38.4 45.3,35.8 | 45.3,35.8 44.63,35.13 IC2.2 | S5.6 28.48,34.38 29.6,35.5 29.6,37.6 30.4,38.4 42.7,38.4 45.3,35.8 | S5.6 25.8,35.67 25.8,37.5 25,38.3 16.1,38.3 13.6,35.8 13.6,34.7 10.28,31.38 S4.6 | IC1.5 25.73,28.02 25.8,28.1 v25.8,30.7 25.8,30.9 | v25.8,32.2 25.6,32.4 24.1,32.4 23.9,32.6 23.9,33.6 24.1,33.8 26.52,33.8 S5.6
  Bottom 0.152: J2.1 37.07,1.73 v34.7,4.1 36.4,5.8 37.8,5.8 38,6 v38,6.1 | v63.1,16.2 63,16.3 U2.2 63,19.9 v62.2,20.7 | v60.3,25.5 61.7,24.1 v62.1,24.1 | v25.8,30.7 v25.8,32.2
MOSI  (via drill 0.4)
  Top 0.152: U1.10 29.41,16.27 29.11,16.27 27.8,14.96 27.8,9.3 33.9,3.21 38.94,3.21 39.87,4.13 | J2.5 39.87,4.13 | 39.87,4.13 40.8,3.2 44.7,3.2 46.1,1.8 58.2,1.8 58.35,1.95 S2.6 58.35,6.65 63.7,12 63.7,14.9 v63.9,15.1 | v63.7,20.7 63.8,20.8 63.2,21.4 61.7,21.4 61.5,21.2 58.8,21.2 58.35,21.65 S1.6 58.35,24.25 58.7,24.6 60.5,24.6 63,27.1 v63,27.9 | v63.1,30 63.15,30.05 J7.3 67.05,30.05 68,31 68,33 66.8,34.2 62.7,34.2 59.5,37.4 49.7,37.4 v49.1,36.8 | IC2.5 42.09,27.89 44.7,30.5 46.8,30.5 47.5,31.2 47.5,36.3 47.3,36.5 v47.2,36.5 | v45.3,36.9 45,36.9 43.1,38.8 30.1,38.8 29.1,37.8 29.1,36 28.73,35.62 v28.2,35.62 S5.7 26.98,35.62 26.2,36.4 26.2,37.7 25.2,38.7 15.7,38.7 13,36 13,35 10.62,32.62 S4.7 | IC1.3 27.05,28.92 27.14,28.92 28.2,29.98 v28.2,30.6
  Bottom 0.152: v63.9,15.1 65,16.2 U2.3 65,19.4 v63.7,20.7 | v63,27.9 63,29.9 v63.1,30 | v49.1,36.8 47.5,36.8 v47.2,36.5 46.8,36.9 v45.3,36.9 | v28.2,30.6 v28.2,35.62
N$1
  Top 0.152: Y1.1 32.95,14.93 U1.17
N$2
  Top 0.152: U1.16 32.37,13.97 31.5,13.1 31.5,10.5 32.18,9.82 Y1.3
N$3
  Top 0.152: J1.2 6.1,6.9 7,6 R1.1
N$4
  Top 0.152: J1.3 5.9,6.25 R2.1
N$5
  Top 0.254: D1.- D2.- 13.42,7.27 U3.3 16,5 C1.2
N$6
  Top 0.152: Q2.3 9.5,19.52 9.5,21 8.74,21.76 R10.1
N$7
  Top 0.152: S2.1 52,5.4 54.6,5.4 54.6,4.06 S2.3
N$8
  Top 0.152: S2.2 53.27,3.23 53.83,2.67 55.57,2.67 55.81,2.91 S2.4
N$9
  Top 0.152: S2.14 52,11.8 54.6,11.8 54.6,13.14 S2.12
N$10
  Top 0.152: C11.2 43.2,8.26 U4.10
N$11
  Top 0.152: S1.1 52,21.5 54.5,21.5 54.54,21.54 S1.3
N$12
  Top 0.152: S1.4 55.81,24.49 55.8,24.5 53.3,24.5 53.3,23.03 S1.2
N$13  (via drill 0.4)
  Top 0.152: S1.14 51.6,32.2 51.4,32.4 v51.5,32.4 | v54.6,33.6 54.6,32.26 S1.12
  Bottom 0.152: v51.5,32.4 53.4,32.4 v54.6,33.6
N$14
  Top 0.152: D3.+ R5.2
N$15
  Top 0.152: D4.+ R6.2
N$16  (via drill 0.4)
  Top 0.152: U1.6 28.15,18.35 27.8,18.7 v27.3,18.7 | v24.5,20.6 21.16,20.6 C13.2
  Bottom 0.152: v27.3,18.7 25.4,20.6 v24.5,20.6
N$19
  Top 0.152: C14.2 31.39,25.37 U1.42
RC_IN
  Top 0.152: R11.1 5,17.09 Q1.1
  Top 0.254: J3.3 4.84,20.08 R11.1 R10.2
RESET  (via drill 0.4)
  Top 0.152: U1.13 30.91,14.41 29,12.5 29,11.24 R8.1 30,8.4 33.3,5.1 35.2,5.1 35.9,4.4 v35.9,4.1
  Bottom 0.152: v35.9,4.1 35.7,3.9 36.7,2.9 41.37,2.9 J2.3
RFM_D0  (via drill 0.4)
  Top 0.152: U1.27 44.25,17.85 53,9.1 v59,9.1
  Bottom 0.152: v59,9.1 59.3,9.1 62.9,5.5 64.2,5.5 65,4.7 U2.14
RFM_D1  (via drill 0.4)
  Top 0.152: v58.1,8.4 56,8.4 55.6,8 53.6,8 44.23,17.37 U1.26
  Bottom 0.152: U2.15 63,4.7 59.7,8 58.3,8 58.1,8.2 v58.1,8.4
RFM_D2  (via drill 0.4)
  Top 0.152: U1.25 44.13,16.87 53.5,7.5 v57.2,7.5
  Bottom 0.152: v57.2,7.5 59.2,7.5 61,5.7 U2.16
RX_INV  (via drill 0.4)
  Top 0.152: Q1.3 7.92,17.1 11,17.1 | 11,17.1 11.9,17.1 11.9,19.5 11.16,20.24 R9.1 | U1.20 34.23,15.13 34.23,15.43 34.02,15.64 32.4,15.64 32.2,15.84 v32.2,16.1 | 11,17.1 11.15,16.95 11.15,13.88 11.93,13.11 22.5,13.11 25.4,16 25.4,16.6 25.7,16.9 26.9,16.9 v27.4,16.4
  Bottom 0.152: v32.2,16.1 27.8,16.1 27.5,16.4 v27.4,16.4
SCK  (via drill 0.4)
  Top 0.152: U1.9 29.43,16.77 29.11,16.77 27.5,15.15 27.5,9.11 33.7,2.9 38.83,2.9 J2.2 41.07,2.8 44.4,2.8 46,1.2 58.8,1.2 59.62,2.02 S2.7 59.62,7.12 64.5,12 64.5,14 v64.6,14.1 | v65.9,20.7 64.9,20.7 63.7,21.9 60.72,21.9 S1.7 64.47,27.85 J7.5 68.25,27.85 68.7,28.3 68.7,33.7 67.7,34.7 63.1,34.7 59.9,37.9 48.9,37.9 48,37 48,35.5 | IC2.6 43.37,28.36 45,30 47,30 48,31 48,35.5 | S5.8 27.86,37.64 | 27.86,37.64 29.43,39.2 | v45.9,37.7 44.4,39.2 29.43,39.2 | v48.9,35.4 48.1,35.4 48,35.5 | S4.8 15.43,39.2 29.43,39.2 | IC1.4 27.12,28.02 29,29.9 v28.9,29.9 | v28.3,37.2 27.86,37.64
  Bottom 0.152: v64.6,14.1 67,16.5 U2.4 67,19.6 v65.9,20.7 | v45.9,37.7 45,37.7 44.4,37.1 44.4,36.4 45.4,35.4 v48.9,35.4 | v28.9,29.9 28.9,36.7 28.3,37.3 v28.3,37.2
SCL  (via drill 0.4)
  Top 0.152: U1.18 33.47,14.91 33.47,14 33.97,13.49 35.2,13.49 | J6.4 31.62,4.38 28,8 27.8,7.8 v27.7,7.8 | v32.2,7.5 34.5,7.5 35.2,8.2 35.2,13.49 | S3.3 35,31.9 | 35,31.9 R3.1 | 35.2,13.49 39.51,13.49 39.8,13.2 v39.8,13.1 | v39.8,14.5 41.3,14.5 42.4,13.4 U4.23 | v39.1,21.5 37.7,22.9 37.7,31 36.8,31.9 35,31.9
  Bottom 0.152: v27.7,7.8 28.1,7.4 32.2,7.4 v32.2,7.5 | v39.8,13.1 v39.8,14.5 39.8,15.5 38.8,16.5 38.8,21.3 38.9,21.3 v39.1,21.5
SDA  (via drill 0.4)
  Top 0.152: U1.19 33.85,14.05 34.1,13.8 36,13.8 | 36,13.8 39,13.8 | 39,13.8 41.4,13.8 42,13.2 U4.24 | J6.3 29.08,4.08 30,5 30,5.4 28.5,6.9 27,6.9 26.7,7.2 v26.7,8.6 | v31.3,8.4 32.5,8.4 32.9,8 34.4,8 34.8,8.4 34.8,12.6 34.7,12.7 v34.5,12.7 | v36.1,14.5 36.1,13.9 36,13.8 | S3.2 R4.1 33.76,31 36.5,31 37.2,30.3 37.2,22 v38,21.2 | 39,13.8 39,15.3 38.4,15.9 v38.4,16
  Bottom 0.152: v26.7,8.6 28.4,8.6 29,8 31,8 31.3,8.3 v31.3,8.4 | v34.5,12.7 36.1,14.3 v36.1,14.5 | v38.4,16 38.4,20.8 v38,21.2
TX_INV  (via drill 0.4)
  Top 0.152: U1.21 34.83,15.37 33.8,16.4 v33.5,16.4 | v26.1,16.2 22.7,12.8 11.8,12.8 10.11,14.49 Q2.1
  Bottom 0.152: v33.5,16.4 33.1,16.8 28.3,16.8 28,17.1 27,17.1 v26.1,16.2
V_RC
  Top 0.254: J3.2 6.87,12.67 D1.+
V_USB  (via drill 0.4)
  Top 0.254: J1.1 7.66,7.55 8.06,7.94 | 8.06,7.94 C15.2 | D2.+ 7.19,10.19 8.06,9.33 8.06,7.94 | U1.2 30.69,20.31 31.3,19.7 31.3,18.3 30.85,17.85 U1.7
  Top 0.305: U1.7 26.05,17.85 22,13.8 v15,13.8 | v9.4,14.1 9,13.7 9,12 7.19,10.19
  Bottom 0.305: v15,13.8 13.9,14.9 10.4,14.9 9.5,14 v9.4,14.1
VCC  (via drill 0.4, 0.6)
  Top 0.152: U1.14 31.39,14.29 30,12.9 R8.2 | C12.2 39.12,11.88 39.24,12 | 53.27,35.86 C2.2 | 55.99,35.9 C9.2 | C18.2 23.44,28.68 IC1.6
  Top 0.203: 40.9,12.1 41.4,12.1 U4.1 41.8,12 42.2,11.7 42.4,11.7 | 42.4,11.7 42.8,11.7 U4.22 | U4.8 42.4,10.2 | 42.4,10.2 42.4,11.7 | U4.13 44.17,10 43.97,10.2 42.4,10.2 | 32,36.76 32,30.24
  Top 0.254: R11.2 6.12,22.88 6.24,23 9.76,23 R9.2 | U1.44 30.41,21.09 30.7,20.8 31,20.8 | 35.33,20.83 U1.34 35.33,22.87 | U1.14 31.39,16.39 | C8.2 43.37,34.83 IC2.3 43.37,31.73 43.5,31.6 v43.5,31.5 | v45.3,28.1 45,27.8 45,27.15 | IC1.8 25,30.18 25,31.4 | C18.2 21.76,28.24 21,29 21,31.4
  Top 0.305: U3.2 U3.TER | 26.54,3.1 J6.2 | C6.2 v37,12.7 | 37.1,16.1 36.81,16.39 U1.24 35.71,16.39 35.3,16.8 | 28.7,5.2 v28.6,5.1 | 55.5,6.6 55.6,6.7 55.8,6.5 v55.8,6.4 | 56.5,10.2 56.6,10.3 v56.7,10.3 | S1.11 55.81,30.61 55.7,30.5 | 53.3,32.17 S1.13 | C17.2 32,36.76 32.76,36.76 S3.1 | S2.13 53.27,14.47 53.89,15.09 C3.2
  Top 0.406: 31,20.8 32,19.8 34.3,19.8 | 34.3,19.8 35.33,20.83 | 34.3,19.8 34.3,17.4 34.3,17.2 32.2,17.2 31.39,16.39 | R4.2 32,30.24 29.86,30.24 28.7,31.4 25,31.4 21,31.4 18,31.4 | 18,31.4 13.6,31.4 10.6,28.4 6.1,28.4 | 6.1,28.4 3.9,30.6 3.9,33.3 4.36,33.76 C10.2 7.79,33.76 S4.1 | 6.12,22.88 6.12,28.38 6.1,28.4 | S5.1 24.79,36.76 C16.2 22.87,36.89 C4.2 18.89,36.89 18,36 18,31.4
  Top 0.508: U3.TER 20.07,4.96 C5.2 25.75,3.89 26.54,3.1 | 35.8,7 35.8,11.1 36.46,11.76 C6.2 37.12,11.88 39.12,11.88 | 35.8,7 35.8,6.6 | 35.8,6.6 35.8,5.93 J2.6 | v37.7,14.9 37.1,15.5 37.1,16.1 | J6.2 26.54,3.04 v28.6,5.1 | v33.2,6.6 35.8,6.6 | C9.2 55.81,35.3 S1.11 | S1.13 53.27,35.86 | C2.2 55.99,35.9 | 35.8,7 39,7 39.4,6.6 55.5,6.6 | 56.5,10.2 55.81,10.89 S2.11 55.81,15.57 C7.2 C3.2 50,19.89 50,24 48.4,25.6 | C12.2 39.34,12.1 40.9,12.1 | 48.4,25.6 46.85,27.15 IC2.8 45,27.15 IC2.7 | 53.3,30.5 55.7,30.5 57.25,28.95 J7.4 | 53.3,30.5 53.3,32.17 | 53.3,30.5 48.4,25.6 | R4.2 R3.2 35.66,30.24 36.3,29.6 36.3,23.84 35.33,22.87 | 35.3,16.8 34.7,17.4 34.3,17.4
  Bottom 0.254: v43.5,31.5 43.5,29.9 v45.3,28.1
  Bottom 0.305: 67,4.9 U2.13
  Bottom 0.508: v37,12.7 37,14.2 v37.7,14.9 | v28.6,5.1 30.1,6.6 v33.2,6.6 | v55.8,6.4 55.8,7.4 57.7,9.3 | 57.7,9.3 58.4,10 59.6,10 63.5,6.1 65.8,6.1 67,4.9 | v56.7,10.3 57.7,9.3

### Text on the board
tPlace: MS5637 | MS5611_2 | MS5525_2 | MS5611_1 | BMP280 | May the lift / be with you | MS5525_1
bPlace: RVario6 / Designed by Patrick Grady the Great / Feb 2019, when I should've been / working on homework instead :/ / Featuring too many pressure sensors / and an IMU!!! | S.PORT / VIN / GND | SCL / SDA / VCC / GND